# EAGLE schematic MoBoxLader (EAGLE 6.5.0)
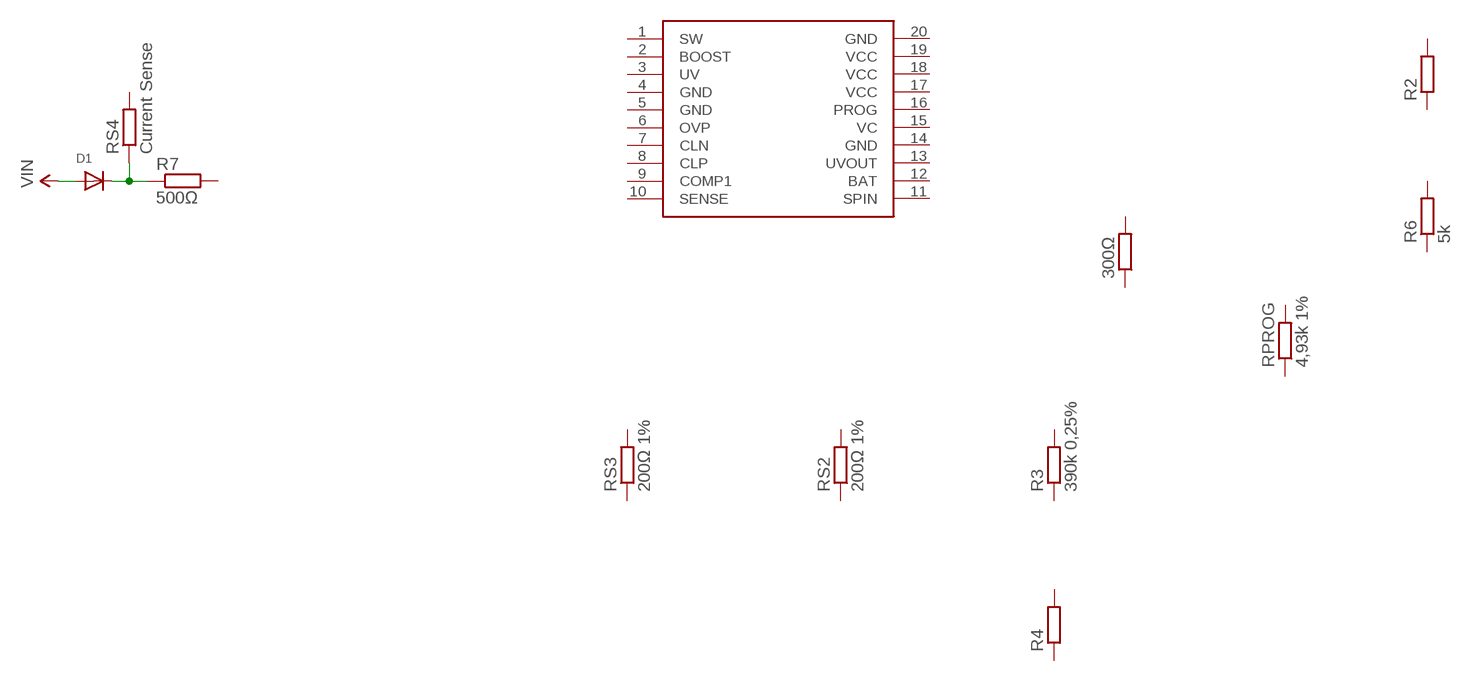
[diagram p0: schematic, sheet 1]

## Parts
300Ω  R-EU_M0805  [M0805]
D1  DIODESMA  [SMADIODE]
R2  R-EU_M0805  [M0805]
R3  390k 0,25%  R-EU_M0805  [M0805]
R4  R-EU_M0805  [M0805]
R6  5k  R-EU_M0805  [M0805]
R7  500Ω  R-EU_M0805  [M0805]
RPROG  4,93k 1%  R-EU_M0805  [M0805]
RS2  200Ω 1%  R-EU_M0805  [M0805]
RS3  200Ω 1%  R-EU_M0805  [M0805]
RS4  Current Sense  R-EU_M0805  [M0805]
U$1  LT1769  [TSSOP24]

## Nets
RS4: D1.C R7.1 RS4.1
VIN: D1.A
Unconnected: 300Ω.1 300Ω.2 R2.1 R2.2 R3.1 R3.2 R4.1 R4.2 R6.1 R6.2 R7.2 RPROG.1 RPROG.2 RS2.1 RS2.2 RS3.1 RS3.2 RS4.2 U$1.1(SW) U$1.2(BOOST) U$1.3(UV) U$1.4(GND) U$1.5(GND) U$1.6(OVP) U$1.7(CLN) U$1.8(CLP) U$1.9(COMP1) U$1.10(SENSE) U$1.11(SPIN) U$1.12(BAT) U$1.13(UVOUT) U$1.14(GND) U$1.15(VC) U$1.16(PROG) U$1.17(VCC) U$1.18(VCC) U$1.19(VCC) U$1.20(GND)

## Library data of the parts
300Ω R2-R4 R6 R7 RPROG RS2-RS4 = rcl:R-EU_: RESISTOR, European symbol
D1 = adafruit:DIODE: Diode SMADIODE - SMA Surface Mount Package 20V 1A Schottky Diode Digikey: 641-1014-6-ND DO-1N4148 - Through Hole Small Current Diode SOD-123 20V 1 A (.5mV Vf) Schottky Diode - Digikey: MBRX120TPMSCT-ND SOD-323 10V 570mA (.38mV Vf, 3ns) Schottky Diode - Digikey: ZLLS410CT-ND SOD-523 30V 30mA Schottky Diode (RB751S-40TE61) - Digikey: RB751S-40TE61CT-ND SOT23-R/W - SOT23 Package (R = Solder Paste/Reflow Ovens, W = Hand-Soldering) BAT54Film 40V 300mA - Digikey: 497-7162-1-ND
U$1 = LT1769:LT1769